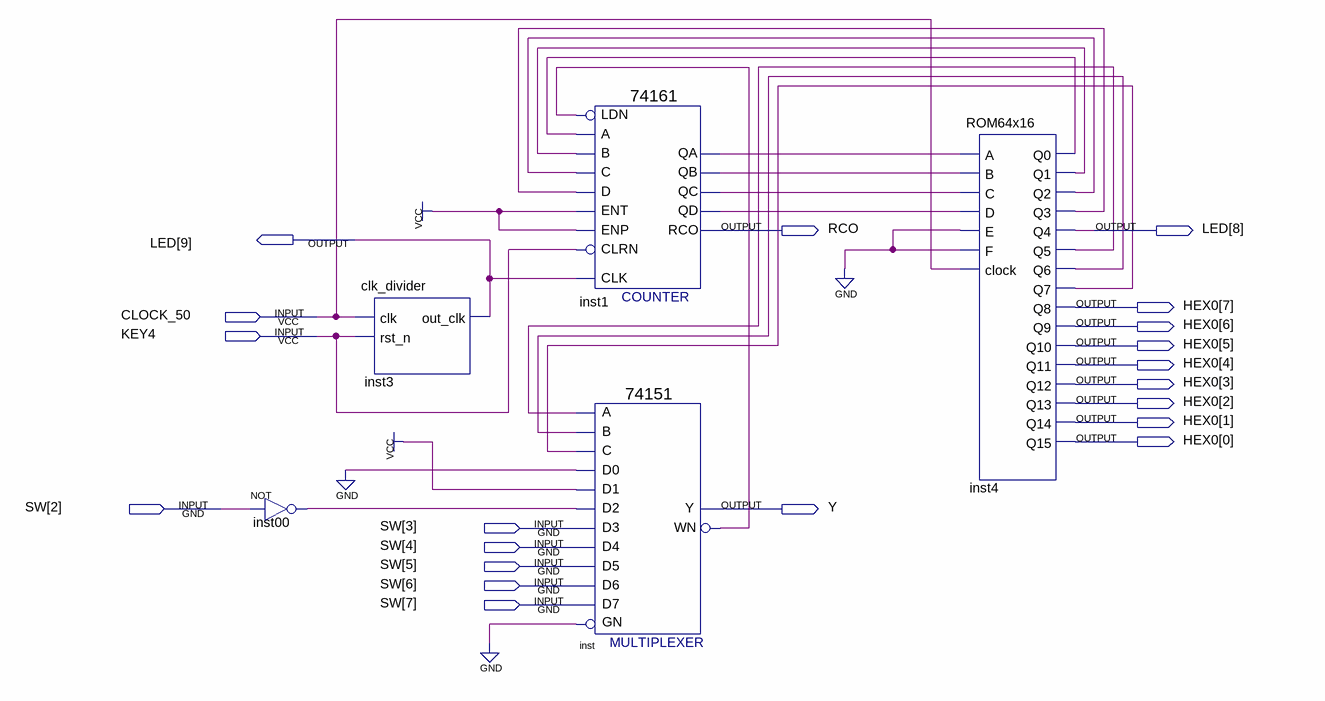
[diagram p0: schematic sheet]
// Quartus schematic PSM.bdf as structural Verilog: 5 symbols, 20 pins
module PSM (
  input  CLOCK_50,
  input  KEY4,
  input  [7:2] SW,
  output RCO,
  output [9:8] LED,
  output [7:0] HEX0,
  output Y
);

  wire inst00_out, inst1_qa, inst1_qb, inst1_qc, inst1_qd, inst4_q0, inst4_q1, inst4_q2, inst4_q3, inst4_q5,
       inst4_q6, inst4_q7, inst_wn;

  not inst00 (inst00_out, SW[2]);
  clk_divider inst3 (.clk(CLOCK_50), .rst_n(KEY4), .out_clk(LED[9]));
  \74161  inst1 (
    .CLRN(KEY4), .CLK(LED[9]), .ENP(1'b1), .LDN(inst_wn), .A(inst4_q0), .D(inst4_q3), .ENT(1'b1),
    .B(inst4_q1), .C(inst4_q2), .QD(inst1_qd), .QC(inst1_qc), .QB(inst1_qb), .QA(inst1_qa), .RCO(RCO));
  \74151  inst (
    .GN(1'b0), .C(inst4_q7), .B(inst4_q6), .A(inst4_q5), .D5(SW[5]), .D0(1'b0), .D1(1'b1), .D4(SW[4]),
    .D3(SW[3]), .D2(inst00_out), .D6(SW[6]), .D7(SW[7]), .Y(Y), .WN(inst_wn));
  ROM64x16 inst4 (
    .A(inst1_qa), .B(inst1_qb), .C(inst1_qc), .D(inst1_qd), .E(1'b0), .F(1'b0), .clock(CLOCK_50),
    .Q0(inst4_q0), .Q1(inst4_q1), .Q2(inst4_q2), .Q3(inst4_q3), .Q4(LED[8]), .Q5(inst4_q5), .Q6(inst4_q6),
    .Q7(inst4_q7), .Q8(HEX0[7]), .Q9(HEX0[6]), .Q10(HEX0[5]), .Q11(HEX0[4]), .Q12(HEX0[3]), .Q13(HEX0[2]),
    .Q14(HEX0[1]), .Q15(HEX0[0]));
endmodule
